# Altium schematic sheet ignition.SchDoc
size 145 x 94 mm; Origin: Eagle
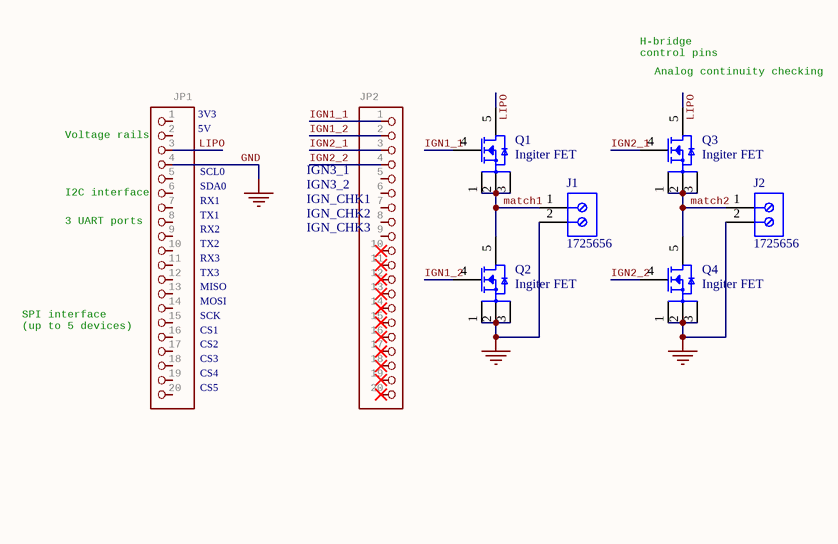
[diagram p0: ignition.SchDoc]

## Parts
J1  1725656  [PHOE-1725656-2]
J2  1725656  [PHOE-1725656-2]
JP1  PINHD-1X20  [1X20]  (value not drawn)
JP2  PINHD-1X20  [1X20]  (value not drawn)
Q1  Ingiter FET  [PSMN5R6-60YLX]
Q2  Ingiter FET  [PSMN5R6-60YLX]
Q3  Ingiter FET  [PSMN5R6-60YLX]
Q4  Ingiter FET  [PSMN5R6-60YLX]

## Nets
GND: J1.2 J2.2 JP1.4 Q2.1 Q2.2 Q2.3 Q4.1 Q4.2 Q4.3
IGN1_1: JP2.1 Q1.4
IGN1_2: JP2.2 Q2.4
IGN2_1: JP2.3 Q3.4
IGN2_2: JP2.4 Q4.4
LIPO: JP1.3 Q1.5 Q3.5
match1: J1.1 Q1.1 Q1.2 Q1.3 Q2.5
match2: J2.1 Q3.1 Q3.2 Q3.3 Q4.5

Not connected (* = marked no-connect by the designer): JP1 1 2 5 6 7 8 9 10 11 12 13 14 15 16 17 18 19 20; JP2 5 6 7 8 9 10* 11* 12* 13* 14* 15* 16* 17* 18* 19* 20*

## Notes on the sheet
- H-bridge
  control pins
- (near JP1) Voltage rails
- (near JP1) 3V3
- (near JP1) 5V
- Analog continuity checking
- (near JP1) I2C interface
- (near JP1) SCL0
- (near JP1) SDA0
- (near JP1) RX1
- (near JP2) IGN3_1
- (near JP2) IGN3_2
- (near JP2) IGN_CHK1
- (near JP1) 3 UART ports
- (near JP1) TX1
- (near JP1) RX2
- (near JP1) TX2
- (near JP1) RX3
- (near JP1) TX3
- (near JP2) IGN_CHK2
- (near JP2) IGN_CHK3
- (near JP1) SPI interface
  (up to 5 devices)
- (near JP1) MISO
- (near JP1) MOSI
- (near JP1) SCK
- (near JP1) CS1
- (near JP1) CS2
- (near JP1) CS3
- (near JP1) CS4
- (near JP1) CS5

## Library data of the parts
J1 J2 = CMP-2000-05299-1: Male Header, Pitch 2.54 mm, 1 x 2 Position, Height 9 mm, Tail Length 3.5 mm; Manufacturer: Phoenix Contact; Number of contacts: 2; Content: 250pc(s); Pitch: 2.54mm; Industrial packaging: Yes; Colour: Green; Manufacturer part No.: 1725656; Type: MPT0,5/2-2,54; Datasheet URL: http://datasheet.octopart.com/1725656-Phoenix-Contact-datasheet-5302866.pdf; Manufacturer URL: http://www.phoenixcontact.com/; Datasheet Version: Apr-08
JP1 JP2 = PINHD-1X20: PIN HEADER; GateName_1: A; SymbolName_1: PINHD20; LibraryName: adafruit; DeviceSetName: PINHD-1X20
Q1-Q4 = PSMN5R6-60YLX: PSMN5R6-60YL - N-channel 60 V, 5.6 mO logic level MOSFET in LFPAK56; Manufacturer: Nexperia; Supplier 1: Mouser; Supplier Part Number 1: 771-PSMN5R6-60YLX; Manufacturer Part Number: PSMN5R6-60YLX; RoHS: Yes; Category: MOSFETs; Stock 1: 26943; Pricing 1: 1=1.17000, 10=1.05000, 50=1.05000, 100=0.82100, 1000=0.54200, 10000=0.45300 (USD); RoHS Compliant: Yes